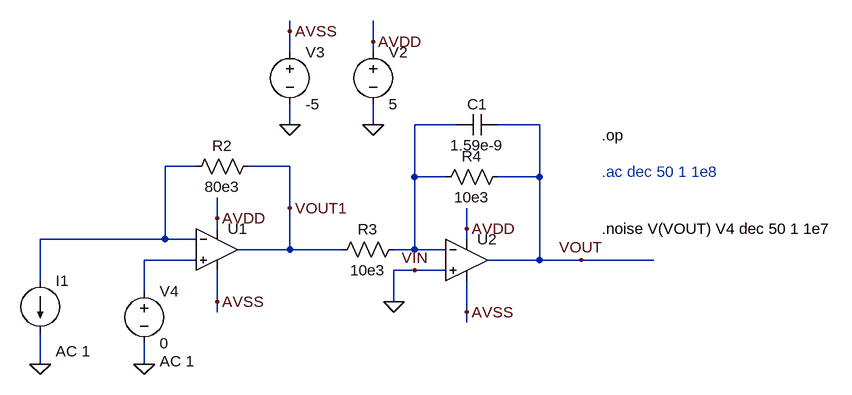
[diagram p0: schematic HW6.asc]
HW6.asc, the LTspice schematic file:
Version 4
SHEET 1 880 680
WIRE -96 -208 -96 -224
WIRE 32 -192 32 -224
WIRE -96 -176 -96 -208
WIRE 32 -176 32 -192
WIRE -96 -64 -96 -96
WIRE 32 -64 32 -96
WIRE 160 -64 96 -64
WIRE 288 -64 224 -64
WIRE -240 0 -288 0
WIRE -96 0 -160 0
WIRE 96 16 96 -64
WIRE 144 16 96 16
WIRE 288 16 288 -64
WIRE 288 16 224 16
WIRE -96 64 -96 0
WIRE -208 80 -208 48
WIRE -208 96 -208 80
WIRE 176 96 176 64
WIRE -288 112 -288 0
WIRE -288 112 -480 112
WIRE -240 112 -288 112
WIRE 176 112 176 96
WIRE -96 128 -96 64
WIRE -96 128 -176 128
WIRE -16 128 -96 128
WIRE 96 128 96 16
WIRE 96 128 64 128
WIRE 144 128 96 128
WIRE -240 144 -320 144
WIRE 288 144 288 16
WIRE 288 144 208 144
WIRE 352 144 288 144
WIRE 464 144 352 144
WIRE 96 160 64 160
WIRE 144 160 96 160
WIRE -480 176 -480 112
WIRE -320 192 -320 144
WIRE -208 208 -208 160
WIRE 64 208 64 160
WIRE -208 224 -208 208
WIRE 176 224 176 176
WIRE 176 240 176 224
WIRE -480 304 -480 256
WIRE -320 304 -320 272
FLAG 32 -64 0
FLAG 32 -192 AVDD
FLAG 176 96 AVDD
FLAG -96 -64 0
FLAG 176 224 AVSS
FLAG -96 -208 AVSS
FLAG 352 144 VOUT
FLAG 64 208 0
FLAG 96 160 VIN
FLAG -208 80 AVDD
FLAG -208 208 AVSS
FLAG -320 304 0
FLAG -96 64 VOUT1
FLAG -480 304 0
DATAFLAG 176 96 ""
DATAFLAG 80 128 ""
DATAFLAG 256 144 ""
DATAFLAG 176 208 ""
DATAFLAG -96 -208 ""
DATAFLAG 32 -208 ""
DATAFLAG -208 80 ""
DATAFLAG -304 112 ""
DATAFLAG -128 128 ""
DATAFLAG -208 192 ""
SYMBOL OpAmps\\UniversalOpamp2 176 144 R0
SYMATTR InstName U2
SYMATTR Value2 Avol=1e6 GBW=10Meg Slew=10Meg
SYMATTR SpiceLine ilimit=25m rail=0 Vos=-1e-3 phimargin=45
SYMBOL res 80 112 R90
WINDOW 0 0 56 VBottom 2
WINDOW 3 32 56 VTop 2
SYMATTR InstName R3
SYMATTR Value 10e3
SYMBOL res 240 0 R90
WINDOW 0 0 56 VBottom 2
WINDOW 3 32 56 VTop 2
SYMATTR InstName R4
SYMATTR Value 10e3
SYMBOL voltage 32 -192 R0
WINDOW 123 0 0 Left 0
WINDOW 39 0 0 Left 0
SYMATTR InstName V2
SYMATTR Value 5
SYMBOL voltage -96 -192 R0
WINDOW 123 0 0 Left 0
WINDOW 39 0 0 Left 0
SYMATTR InstName V3
SYMATTR Value -5
SYMBOL OpAmps\\UniversalOpamp2 -208 128 R0
SYMATTR InstName U1
SYMATTR Value2 Avol=1e6 GBW=10Meg Slew=10Meg
SYMATTR SpiceLine ilimit=25m rail=0 Vos=1e-3 phimargin=45
SYMBOL res -144 -16 R90
WINDOW 0 0 56 VBottom 2
WINDOW 3 32 56 VTop 2
SYMATTR InstName R2
SYMATTR Value 80e3
SYMBOL voltage -320 176 R0
WINDOW 123 24 124 Left 2
WINDOW 39 0 0 Left 0
SYMATTR Value2 AC 1
SYMATTR InstName V4
SYMATTR Value 0
SYMBOL cap 224 -80 R90
WINDOW 0 0 32 VBottom 2
WINDOW 3 32 32 VTop 2
SYMATTR InstName C1
SYMATTR Value 1.59e-9
SYMBOL current -480 176 R0
WINDOW 123 24 108 Left 2
WINDOW 39 0 0 Left 0
SYMATTR Value2 AC 1
SYMATTR InstName I1
SYMATTR Value ""
TEXT 384 -48 Left 2 !.op
TEXT 384 8 Left 2 ;.ac dec 50 1 1e8
TEXT 384 96 Left 2 !.noise V(VOUT) V4 dec 50 1 1e7

The netlist it stands for:
* HW6.asc
XU2 0 N001 AVDD AVSS VOUT level.2 Avol=1e6 GBW=10Meg Slew=10Meg ilimit=25m rail=0 Vos=-1e-3 phimargin=45 en=0 enk=0 in=0 ink=0 Rin=500Meg  ; pins IN+ IN- V+ V- OUT
R3 N001 VOUT1 10e3
R4 VOUT N001 10e3
V2 AVDD 0 5
V3 AVSS 0 -5
XU1 N003 N002 AVDD AVSS VOUT1 level.2 Avol=1e6 GBW=10Meg Slew=10Meg ilimit=25m rail=0 Vos=1e-3 phimargin=45 en=0 enk=0 in=0 ink=0 Rin=500Meg  ; pins IN+ IN- V+ V- OUT
R2 VOUT1 N002 80e3
V4 N003 0 0 AC 1
C1 VOUT N001 1.59e-9
I1 N002 0 AC 1
.op
* .ac dec 50 1 1e8
.noise V(VOUT) V4 dec 50 1 1e7
.lib UniversalOpamps2.sub
.backanno
.end